# Altium schematic sheet 02_Input Connectors.SchDoc
size A3; SheetNumber: 2; SheetTotal: 14
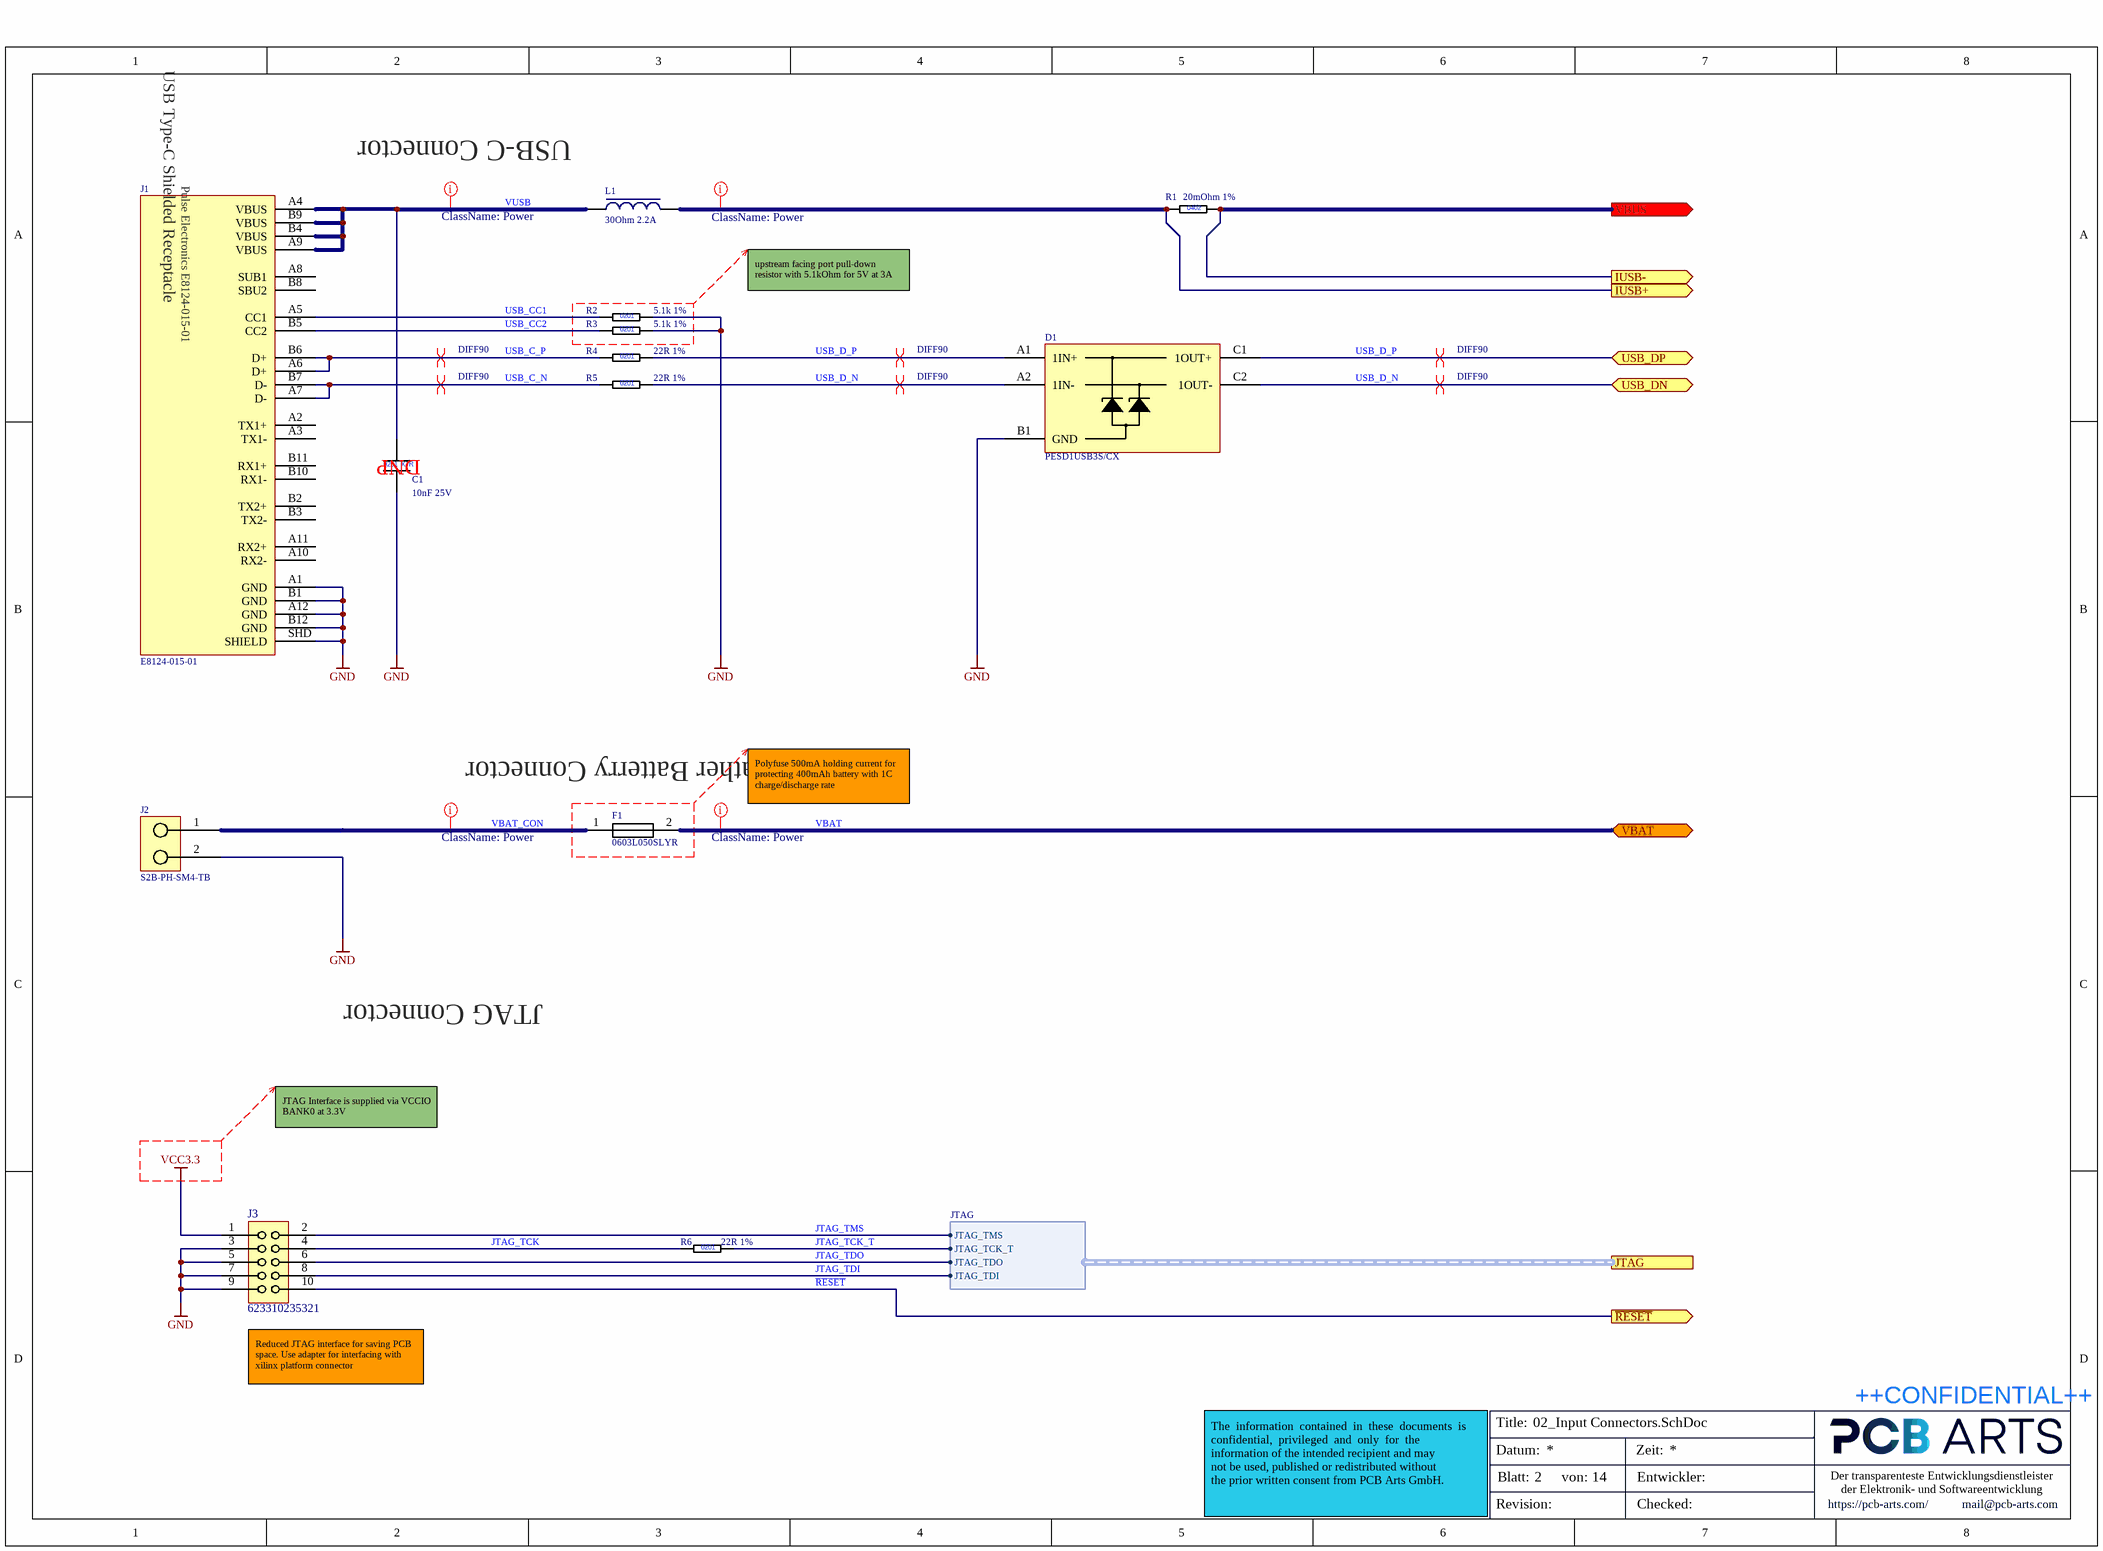
[diagram p0: 02_Input Connectors.SchDoc]

## Parts
C1  10nF 25V  [CAPC0603X03L]
D1  PESD1USB3S/CX  [BGAS5C40P2X3_77X117X60]
F1  0603L050SLYR  [0603L050SLYR]
J1  E8124-015-01  [E8124-015-01]
J2  S2B-PH-SM4-TB  [S2B-PH-SM4-TB]
J3  623310235321  [623310235321_NBE]
L1  30Ohm 2.2A  [INDC1005X06L]
R1  20mOhm 1%  [RESC1005X04L]
R2  5.1k 1%  [RESC0603X03L]
R3  5.1k 1%  [RESC0603X03L]
R4  22R 1%  [RESC0603X03L]
R5  22R 1%  [RESC0603X03L]
R6  22R 1%  [RESC0603X03L]

## Ports
IUSB+ (out), IUSB- (out), JTAG (harness JTAG), USB_DN (bidir), USB_DP (bidir), VBAT (bidir), VBUS (out), ~{RESET} (out)

## Harnesses
JTAG: JTAG_TMS, JTAG_TDO, JTAG_TDI, JTAG_TCK_T

## Nets
GND: C1.2 D1.B1(GND) J1.A1(GND) J1.A12(GND) J1.B1(GND) J1.B12(GND) J1.SHD(SHIELD) J2.2 J3.3 J3.5 J3.7 J3.9 R2.2 R3.2
VCC3.3: J3.1
IUSB+: L1.1 R1.1 ; port IUSB+
IUSB-: R1.2 ; port VBUS, port IUSB-
JTAG_TCK: J3.4 R6.1
JTAG_TCK_T: R6.2 ; port JTAG.JTAG_TCK_T
JTAG_TDI: J3.8 ; port JTAG.JTAG_TDI
JTAG_TDO: J3.6 ; port JTAG.JTAG_TDO
JTAG_TMS: J3.2 ; port JTAG.JTAG_TMS
~{RESET}: J3.10 ; port ~{RESET}
USB_C_N: J1.A7(D-) J1.B7(D-) R5.1
USB_C_P: J1.A6(D+) J1.B6(D+) R4.1
USB_CC1: J1.A5(CC1) R2.1
USB_CC2: J1.B5(CC2) R3.1
USB_D_N: D1.A2(1IN-) D1.C2(1OUT-) R5.2 ; port USB_DN
USB_D_P: D1.A1(1IN+) D1.C1(1OUT+) R4.2 ; port USB_DP
VBAT: F1.2 ; port VBAT
VBAT_CON: F1.1 J2.1
VUSB: C1.1 J1.A4(VBUS) J1.A9(VBUS) J1.B4(VBUS) J1.B9(VBUS) L1.2

Not connected (* = marked no-connect by the designer): J1 A2(TX1+) A3(TX1-) A8(SUB1) A10(RX2-) A11(RX2+) B2(TX2+) B3(TX2-) B8(SBU2) B10(RX1-) B11(RX1+)

## Layout directives
net class Power: IUSB+, VBAT, VBAT_CON, VUSB
differential pair; net class DIFF90: USB_C_N, USB_C_P, USB_D_N, USB_D_P

## Notes on the sheet
- (near J1) USB-C Connector
- upstream facing port pull-down resistor with 5.1kOhm for 5V at 3A
- (near C1) DNP
- (near J2) Feather Batterry Connector
- Polyfuse 500mA holding current for protecting 400mAh battery with 1C charge/discharge rate
- JTAG Connector
- JTAG Interface is supplied via VCCIO BANK0 at 3.3V
- (near J3) Reduced JTAG interface for saving PCB space. Use adapter for interfacing with xilinx platform connector
- Title:
- ++CONFIDENTIAL++
- Datum:
- Blatt:
- von:
- Zeit:
- Entwickler:
- Der transparenteste Entwicklungsdienstleister
  der Elektronik- und Softwareentwicklung
- The  information  contained  in  these  documents  is  confidential,  privileged  and  only  for  the
  information of the intended recipient and may
  not be used, published or redistributed without
  the prior written consent from PCB Arts GmbH.
- Revision:
- Checked:
- https://pcb-arts.com/
- mail@pcb-arts.com
- (in symbol CAP_0201_10nF_25V) 0201; X7R
- (in symbol E8124-015-01_USB Type-C Receptacle) USB Type-C Shielded Receptacle; Pulse Electronics E8124-015-01
- (in symbol RES_0201_5.1k_1%) 0201
- (in symbol RES_0201_22R_1%) 0201
- (in symbol RES_0402_20mR_1%) 0402

## Library data of the parts
C1 = CAP_0201_10nF_25V: Multilayer Ceramic Capacitors MLCC - SMD/SMT 0201 25VDC; Manufacturer 1: Murata Electronics; Manufacturer 1 Prt. Nr.: GRM033C81E103KE14D; Manufacturer 2 Prt. Nr.: 02013C103KAT2A; Manufacturer 2: AVX
D1 = PESD1USB3S/CX_ESD Suppressors / TVS Diodes PESD1USB3S/NAX000: ESD Suppressors / TVS Diodes PESD1USB3S/NAX000; Manufacturer 1: Nexperia; Manufacturer 1 Prt. Nr.: PESD1USB3S/CX
F1 = 0603L050SLYR_PPTC 6V POLYFUSE 0603 LoRho SL 0.50A: Resettable Fuses - PPTC 6V POLYFUSE 0603 LoRho SL 0.50A; Manufacturer 1: Littelfuse; Manufacturer 1 Prt. Nr.: 0603L050SLYR
J1 = E8124-015-01_USB Type-C Receptacle: USB-Stecker USB 3.1 TYPE C 10G Top Mount; Manufacturer 1: Pulse Electronics; Manufacturer 1 Prt. Nr.: E8124-015-01
J2 = S2B-PH-SM4-TB JST Automotive 2mm pitch connector: JST Automotive 2mm pitch crimp style connector; Manufacturer 1: JST Sales America Inc.; Manufacturer 1 Prt. Nr.: S2B-PH-SM4-TB
J3 = 623310235321_WR-PHD 1.27 mm SMT Dual Socket Header: WR-PHD 1.27 mm SMT Dual Socket Header, H=2.20 mm; Manufacturer 1: Würth elektronik; Manufacturer 1 Prt. Nr.: 623310235321
L1 = FLT_0402_30Ohm_2.2A: Ferrite Bead 0402 30Ohm 2.2A 25%; Manufacturer Prt. Nr.: BLM15PD300SZ1D; Manufacturer: Murata Electronics
R1 = RES_0402_20mR_1%: Thick Film Resistors - SMD 20mOHM 1%; Manufacturer 1: Yageo; Manufacturer 1 Prt. Nr.: PA0402FRL7T0R02L
R2 R3 = RES_0201_5.1k_1%: Thick Film Resistors - SMD 5.1K OHM 1%; Manufacturer 1: Yageo; Manufacturer 1 Prt. Nr.: RC0201FR-075K1L; Manufacturer 2 Prt. Nr.: CRCW02015K10FKED; Manufacturer 2: Vishay / Dale
R4-R6 = RES_0201_22R_1%: Thick Film Resistors - SMD 22R OHM 1%; Manufacturer 1: Yageo; Manufacturer 1 Prt. Nr.: RC0201FR-0722RL; Manufacturer 2 Prt. Nr.: CRCW020122R0FNED; Manufacturer 2: Vishay / Dale